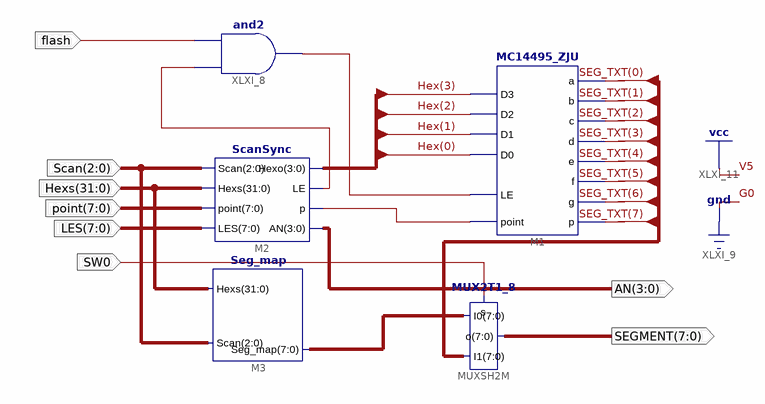
[diagram p0: schematic sheet 1]
// Xilinx ISE schematic Seg7_Dev.sch (kintex7) as structural Verilog: 5 symbols, 8 ports
module Seg7_Dev (
  input  flash,
  input  [7:0] point,
  input  [2:0] Scan,
  input  SW0,
  input  [7:0] LES,
  input  [31:0] Hexs,
  output [3:0] AN,
  output [7:0] SEGMENT
);

  wire LE, point0, XLXN_4;
  wire [3:0] Hex;
  wire [7:0] SEG_TXT, XLXN_24;

  MC14495_ZJU M1 (
    .D0(Hex[0]), .D1(Hex[1]), .D2(Hex[2]), .D3(Hex[3]), .p(SEG_TXT[7]), .g(SEG_TXT[6]), .f(SEG_TXT[5]),
    .e(SEG_TXT[4]), .d(SEG_TXT[3]), .c(SEG_TXT[2]), .b(SEG_TXT[1]), .a(SEG_TXT[0]), .point(point0), .LE(LE));
  ScanSync M2 (.LES(LES), .AN(AN), .point(point), .p(point0), .Hexo(Hex), .Hexs(Hexs), .Scan(Scan), .LE(XLXN_4));
  Seg_map M3 (.Hexs(Hexs), .Seg_map(XLXN_24), .Scan(Scan));
  MUX2T1_8 MUXSH2M (.o(SEGMENT), .I0(XLXN_24), .s(SW0), .I1(SEG_TXT));
  and XLXI_8 (LE, XLXN_4, flash);
endmodule
